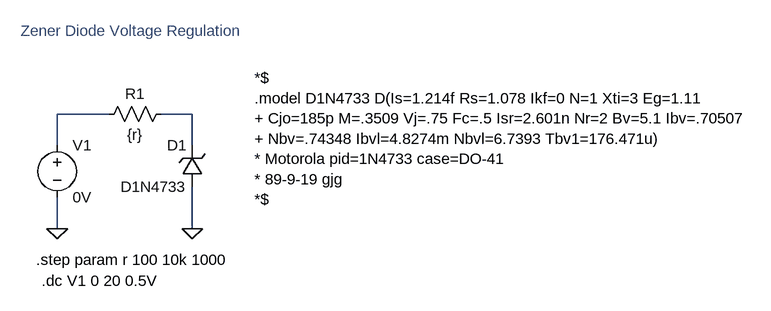
[diagram p0: schematic zener_diode.asc]
zener_diode.asc, the LTspice schematic file:
Version 4.1
SHEET 1 1256 680
WIRE 176 80 96 80
WIRE 304 80 256 80
WIRE 96 128 96 80
WIRE 304 128 304 80
WIRE 96 256 96 208
WIRE 304 256 304 192
FLAG 96 256 0
FLAG 304 256 0
SYMBOL voltage 96 112 R0
WINDOW 123 0 0 Left 0
WINDOW 39 0 0 Left 0
SYMATTR InstName V1
SYMATTR Value 0V
SYMBOL res 272 64 R90
WINDOW 0 0 56 VBottom 2
WINDOW 3 32 56 VTop 2
SYMATTR InstName R1
SYMATTR Value {r}
SYMBOL zener 320 192 R180
WINDOW 0 24 64 Left 2
WINDOW 3 24 0 Left 2
SYMATTR InstName D1
SYMATTR Value D1N4733
TEXT 400 24 Left 2 !*$\n.model D1N4733 D(Is=1.214f Rs=1.078 Ikf=0 N=1 Xti=3 Eg=1.11\n+ Cjo=185p M=.3509 Vj=.75 Fc=.5 Isr=2.601n Nr=2 Bv=5.1 Ibv=.70507\n+ Nbv=.74348 Ibvl=4.8274m Nbvl=6.7393 Tbv1=176.471u)\n* Motorola pid=1N4733 case=DO-41\n* 89-9-19 gjg\n*$
TEXT 64 304 Left 2 !.step param r 100 10k 1000
TEXT 72 336 Left 2 !.dc V1 0 20 0.5V
TEXT 40 -48 Left 2 ;Zener Diode Voltage Regulation

The netlist it stands for:
* zener_diode.asc
V1 N001 0 0V
R1 N002 N001 {r}
D1 0 N002 D1N4733
.model D D
.lib standard.dio
*$
.model D1N4733 D(Is=1.214f Rs=1.078 Ikf=0 N=1 Xti=3 Eg=1.11
+ Cjo=185p M=.3509 Vj=.75 Fc=.5 Isr=2.601n Nr=2 Bv=5.1 Ibv=.70507
+ Nbv=.74348 Ibvl=4.8274m Nbvl=6.7393 Tbv1=176.471u)
* Motorola pid=1N4733 case=DO-41
* 89-9-19 gjg
*$
.step param r 100 10k 1000
.dc V1 0 20 0.5V
* Zener Diode Voltage Regulation
.backanno
.end